# Altium schematic sheet wtc.SchDoc
size 414 x 293 mm; SheetNumber: 1; SheetTotal: 4
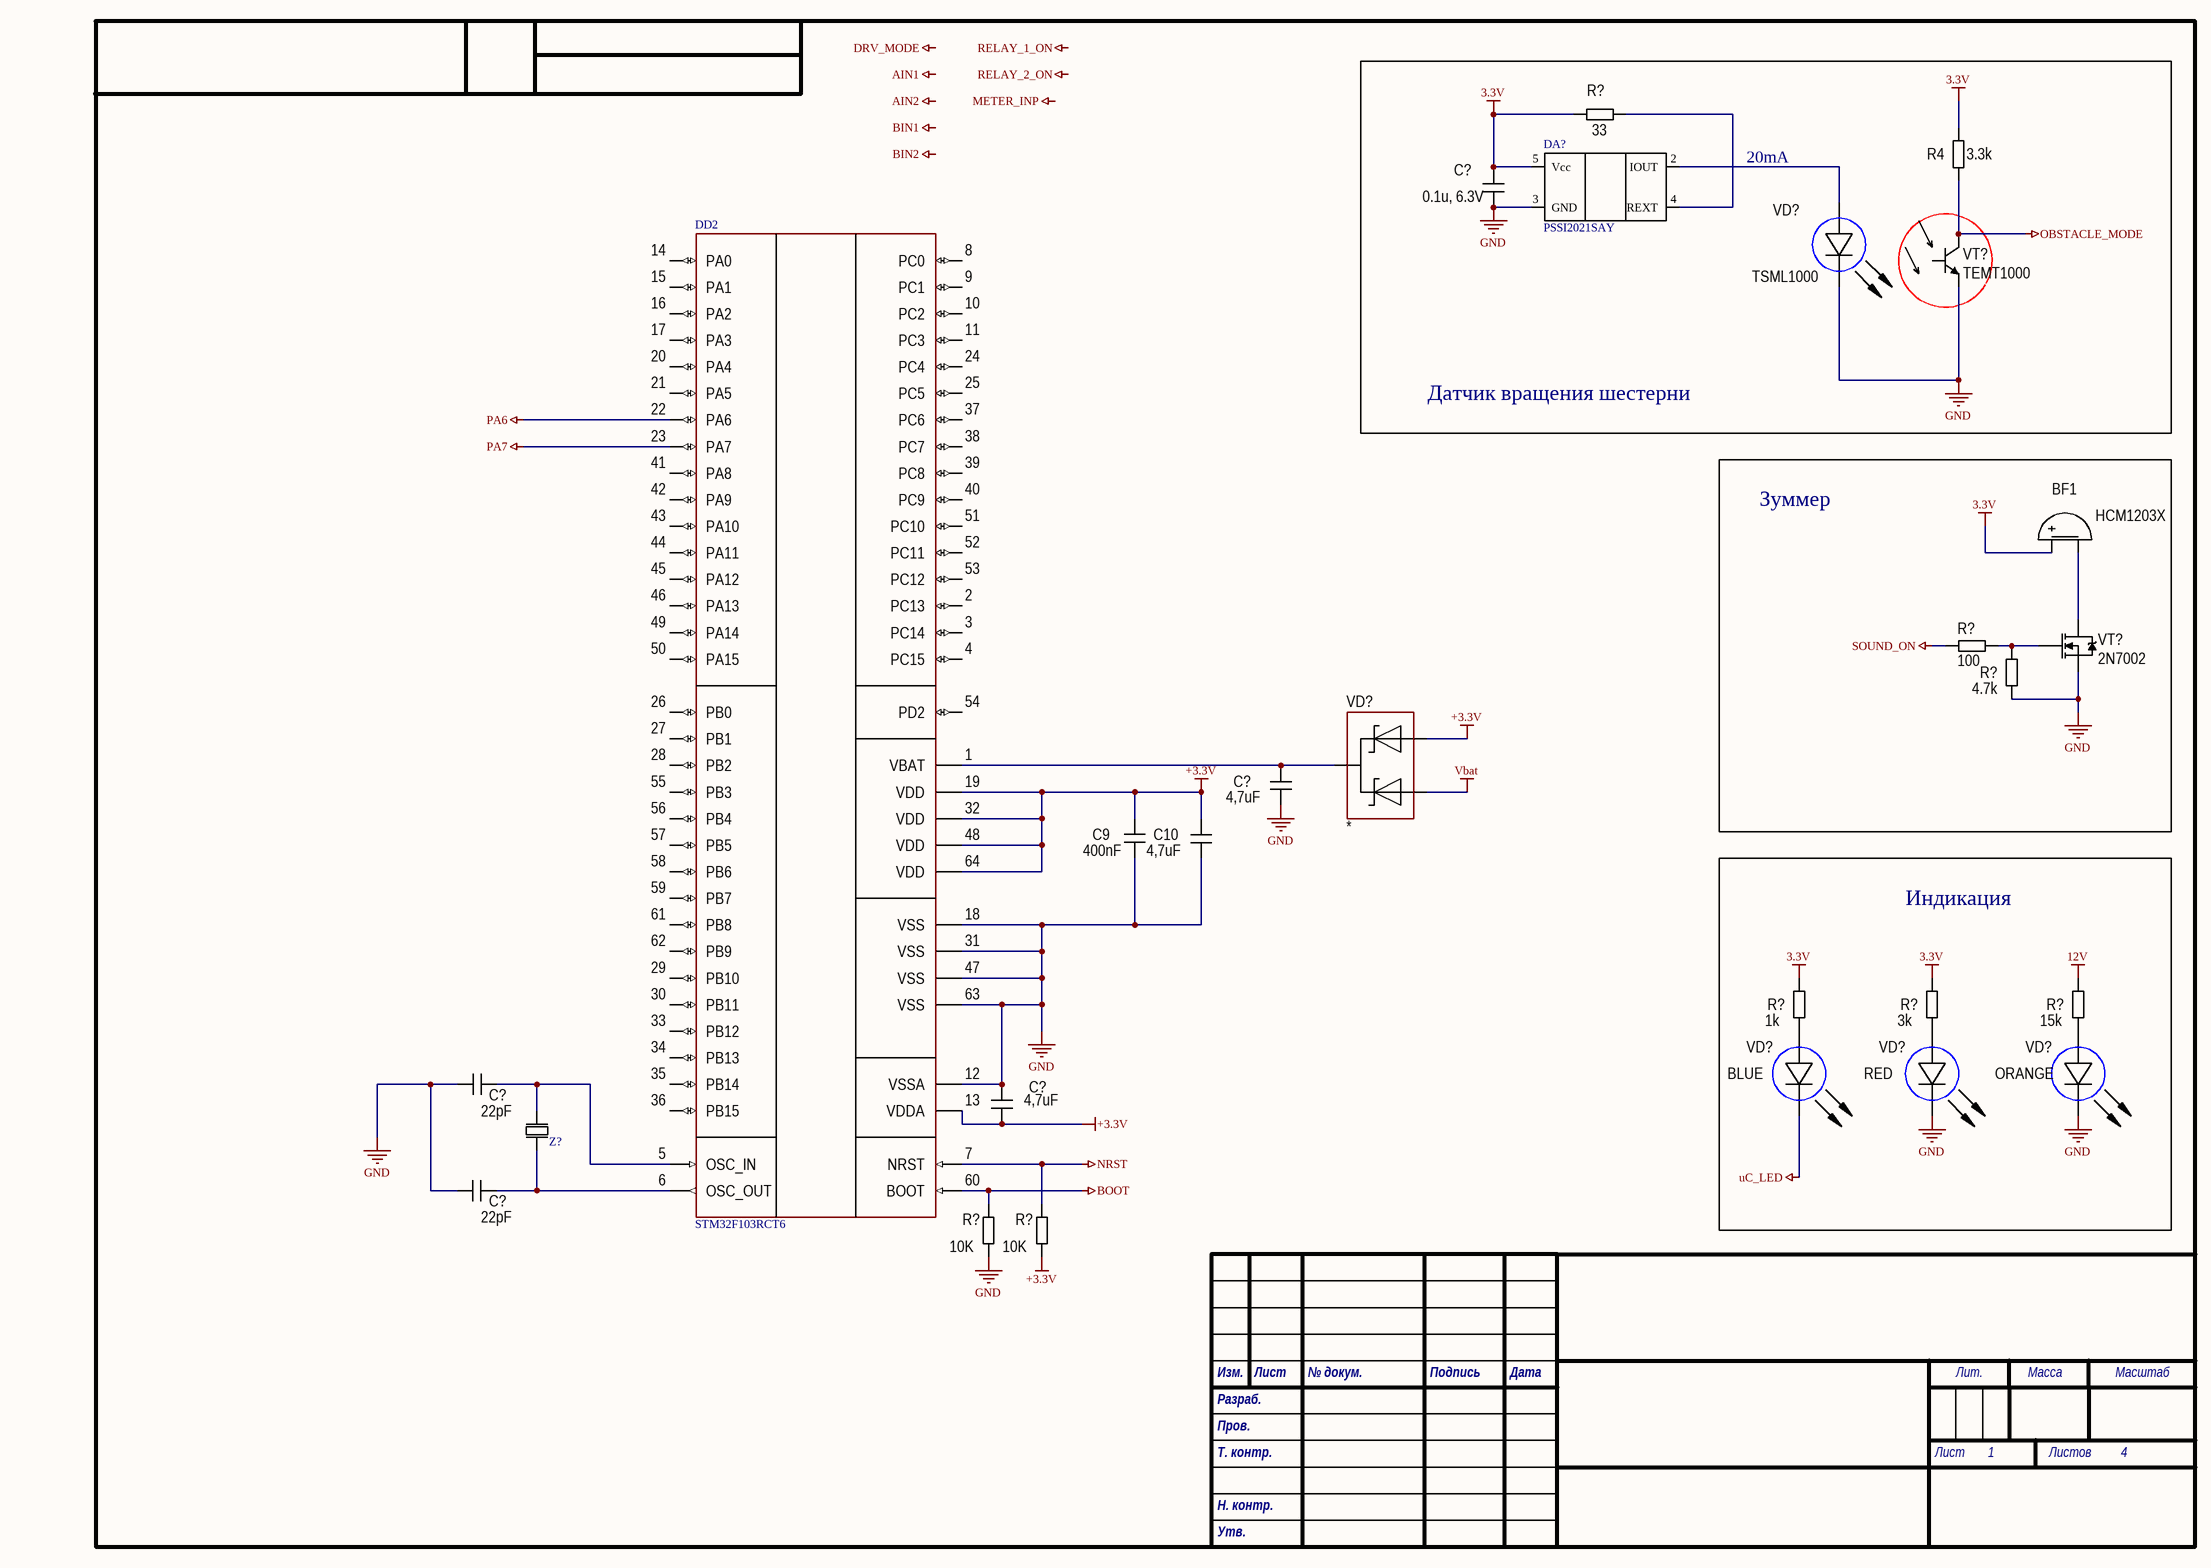
[diagram p0: wtc.SchDoc]

## Parts
(Parts that share a designator on the sheet are numbered #1, #2 ... from top to bottom, then left to right.)
BF1  HCM1203X  [BUZ: AI-1223-TWT-3V-2-R]
C9  400nF  [CH0402C]
C10  4,7uF  [CH0402C]
C?#1  0.1u, 6.3V  [CH0805C]
C?#2  4,7uF  [CH0402C]
C?#3  22pF  [CH0402C]
C?#4  4,7uF  [CH0402C]
C?#5  22pF  [CH0402C]
DA?  PSSI2021SAY
DD2  STM32F103RCT6  [64-LQFP]
R4  3.3k  [CH0805R]
R?#1  33  [CH0805R]
R?#2  100  [CH0805R]
R?#3  4.7k  [CH0805R]
R?#4  1k  [CH0805R]
R?#5  3k  [CH0805R]
R?#6  15k  [CH0805R]
R?#7  10K  [CH0805R]
R?#8  10K  [CH0805R]
VD?#1  TSML1000  [CH0603LB]
VD?#2  *  [SOT23_123]
VD?#3  BLUE  [CH0603LB]
VD?#4  RED  [CH0603LB]
VD?#5  ORANGE  [CH0603LB]
VT?#1  TEMT1000  [8-HSOF]
VT?#2  2N7002  [SOT23_123]
Z?  qurtz  [SMD 32.768KHz]  (value not drawn)

## Blocks framed on the sheet
Датчик вращения шестерни: C?#1 DA? R4 R?#1 VD?#1 VT?#1
Зуммер: BF1 R?#2 R?#3 VT?#2
Индикация: R?#4-R?#6 VD?#3-VD?#5

## Nets
3.3V: BF1.1(+) C?#1.2 DA?.5(Vcc) R4.2 R?#1.2 R?#4.2 R?#5.2
12V: R?#6.2
+3.3V: C9.1 C10.2 C?#4.1 DD2.13(VDDA) DD2.19(VDD) DD2.32(VDD) DD2.48(VDD) DD2.64(VDD) R?#8.1 VD?#2.1
BOOT: DD2.60(BOOT) R?#7.2
GND: C9.2 C10.1 C?#1.1 C?#2.1 C?#3.2 C?#4.2 C?#5.1 DA?.3(GND) DD2.12(VSSA) DD2.18(VSS) DD2.31(VSS) DD2.47(VSS) DD2.63(VSS) R?#3.1 R?#7.1 VD?#1.2(C) VD?#4.2(C) VD?#5.2(C) VT?#1.3(E) VT?#2.3(S)
NRST: DD2.7(NRST) R?#8.2
OBSTACLE_MODE: R4.1 VT?#1.2(C)
PA6: DD2.22(PA6)
PA7: DD2.23(PA7)
SOUND_ON: R?#2.2
uC_LED: VD?#3.2(C)
Vbat: VD?#2.3
NetBF1_2: BF1.2(-) VT?#2.2(D)
NetC?#2_2: C?#2.2 DD2.1(VBAT) VD?#2.2
NetC?#3_1: C?#3.1 DD2.5(OSC_IN) Z?.2
NetC?#5_2: C?#5.2 DD2.6(OSC_OUT) Z?.1
NetDA?_2: DA?.2(IOUT) VD?#1.1(A)
NetDA?_4: DA?.4(REXT) R?#1.1
NetR?#2_1: R?#2.1 R?#3.2 VT?#2.1(G)
NetR?#4_1: R?#4.1 VD?#3.1(A)
NetR?#5_1: R?#5.1 VD?#4.1(A)
NetR?#6_1: R?#6.1 VD?#5.1(A)

Not connected (* = marked no-connect by the designer): DD2 2(PC13) 3(PC14) 4(PC15) 8(PC0) 9(PC1) 10(PC2) 11(PC3) 14(PA0) 15(PA1) 16(PA2) 17(PA3) 20(PA4) 21(PA5) 24(PC4) 25(PC5) 26(PB0) 27(PB1) 28(PB2) 29(PB10) 30(PB11) 33(PB12) 34(PB13) 35(PB14) 36(PB15) 37(PC6) 38(PC7) 39(PC8) 40(PC9) 41(PA8) 42(PA9) 43(PA10) 44(PA11) 45(PA12) 46(PA13) 49(PA14) 50(PA15) 51(PC10) 52(PC11) 53(PC12) 54(PD2) 55(PB3) 56(PB4) 57(PB5) 58(PB6) 59(PB7) 61(PB8) 62(PB9); VT?#1 1(B)

## Notes on the sheet
- 20mA
- Labels drawn without touching a wire or pin: AIN1, AIN2, BIN1, BIN2, DRV_MODE, METER_INP, RELAY_1_ON, RELAY_2_ON
- Изм.
- Лист
- № докум.
- Подпись
- Дата
- Лит.
- Масса
- Масштаб
- Пров.
- Разраб.
- Т. контр.
- Н. контр.
- Листов
- Утв.

## Library data of the parts
BF1 = Buzzer: Manufacturer: PUI Audio, Inc.; Model: AI-1223-TWT-3V-2-R; HelpURL: https://www.digikey.com/product-detail/en/pui-audio-inc/AI-1223-TWT-3V-2-R/668-1456-ND/5011391; ComponentKind: Internally Driven
C9 C10 C?#1-C?#5 = Capacitor: Manufacturer: *; Model: *; HelpURL: *; ComponentKind: *; Value: *
DA? = PSSI2021SAY: Iout = 0.617/Rext + 15 µA
DD2 = STM32F103RCT6: Cortex-M3
R4 R?#1-R?#8 = Resistor: Manufacturer: *; Model: *; HelpURL: *; ComponentKind: *; Value: *
VD?#1 VD?#3-VD?#5 = LED_1: Manufacturer: *; Model: *; HelpURL: *; ComponentKind: *; Value: *
VD?#2 = Diod Schottky Array v.1: ComponentKind: *; Manufacturer: *; Model: *; HelpURL: *
VT?#1 = NPN: Bipolar; Model: *; Manufacturer: *; ComponentKind: *; HelpURL: *
VT?#2 = N-chanel: Mosfet; Model: *; Manufacturer: *; ComponentKind: *; HelpURL: *
Z? = Kvarc_32,768